# EAGLE design Campesinoi2c (EAGLE 9.6.2)
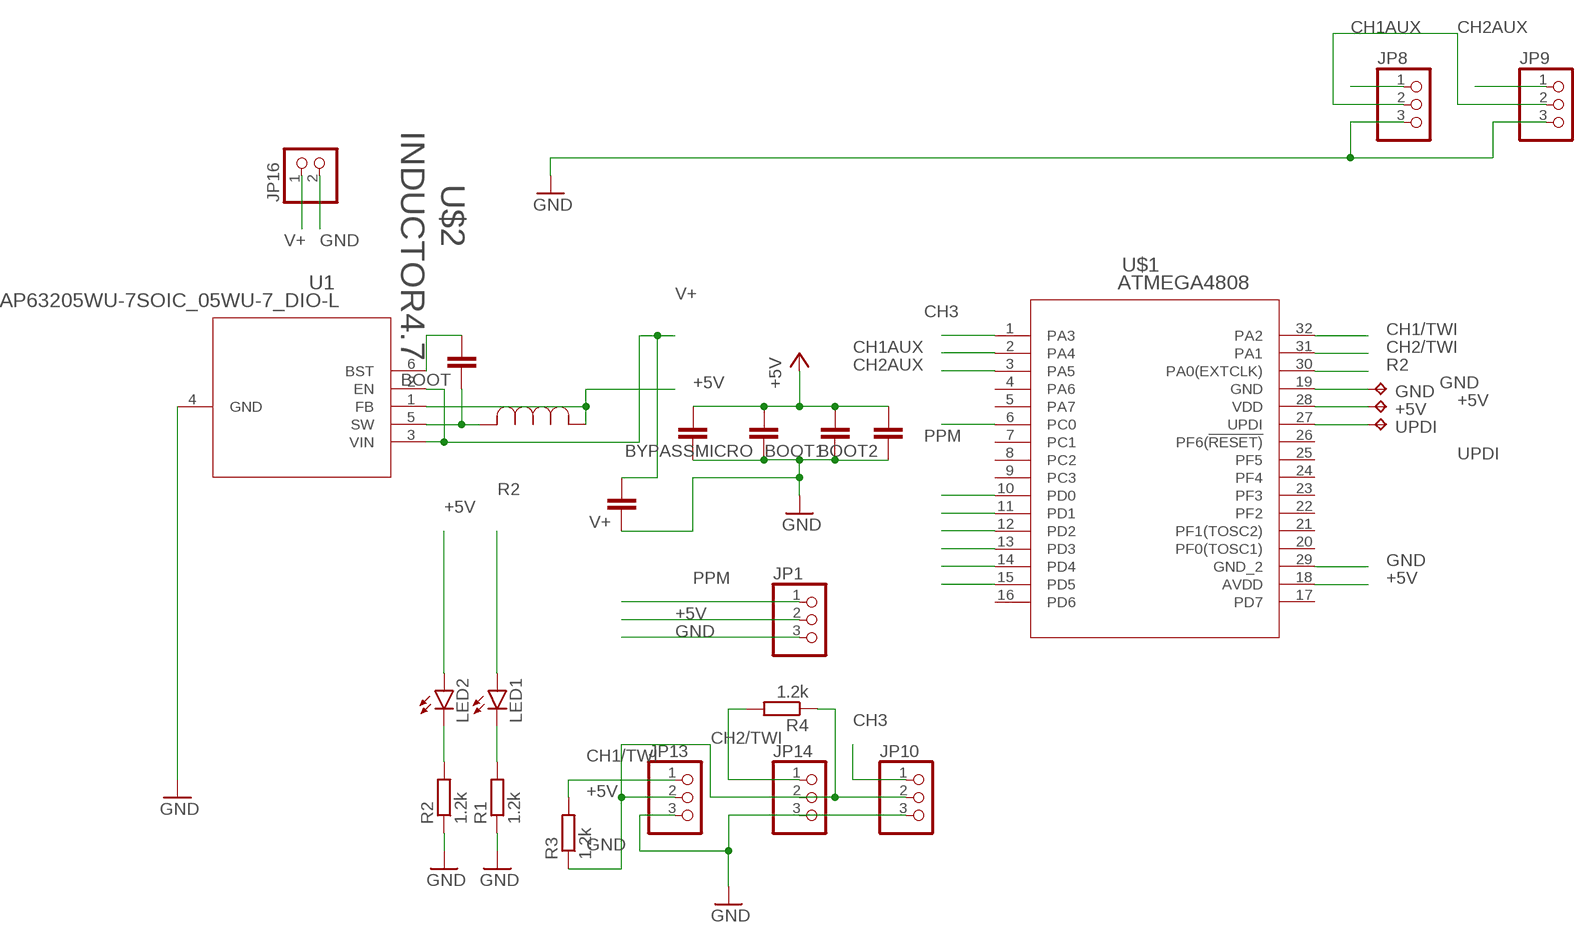
[diagram p0: schematic, sheet 1]

## Parts
+5V  TPB1,27  [B1,27]
BOOT  C-EUC0402  [C0402]
BOOT1  C-EUC0402  [C0402]
BOOT2  C-EUC0402  [C0402]
BYPASSMICRO  C-EUC0603  [C0603]
BYPASSMICRO2  C-EUC0603  [C0603]
GND  TPB1,27  [B1,27]
JP1  PINHD-1X03_2.54-S  [1X03-S]
JP8  PINHD-1X03_2.54-S  [1X03-S]
JP9  PINHD-1X03_2.54-S  [1X03-S]
JP10  PINHD-1X03_2.54-S  [1X03-S]
JP13  PINHD-1X03_2.54-S  [1X03-S]
JP14  PINHD-1X03_2.54-S  [1X03-S]
JP16  PINHD-1X02_2.54-S  [1X02-S]
LED1  LEDCHIPLED_0603  [CHIPLED_0603]
LED2  LEDCHIPLED_0603  [CHIPLED_0603]
R1  1.2k  R-EU_R0603  [R0603]
R2  1.2k  R-EU_R0603  [R0603]
R3  1.2k  R-EU_R0603  [R0603]
R4  1.2k  R-EU_R0603  [R0603]
U1  AP63205WU-7SOIC_05WU-7_DIO-L  [SOIC_05WU-7_DIO-L]
U$1  ATMEGA4808  [QFP80P900X900X120-32N]
U$2  INDUCTOR4.7  [IND_NRS5030T100MMGJ_TAY]
UPDI  TPB1,27  [B1,27]
V+  C-EUC1206  [C1206]

## Nets
+5V: +5V.TP BOOT1.2 BOOT2.2 BYPASSMICRO2.2 BYPASSMICRO.2 JP1.2 JP8.2 JP9.2 JP10.2 JP13.2 JP14.2 LED2.A R3.1 R4.1 U1.1(FB) U$1.18(AVDD) U$1.28(VDD) U$2.1
CH1/TWI: JP13.1 R3.2 U$1.32(PA2)
CH1AUX: JP8.1 U$1.2(PA4)
CH2/TWI: JP14.1 R4.2 U$1.31(PA1)
CH2AUX: JP9.1 U$1.3(PA5)
CH3: JP10.1 U$1.1(PA3)
GND: BOOT1.1 BOOT2.1 BYPASSMICRO2.1 BYPASSMICRO.1 GND.TP JP1.3 JP8.3 JP9.3 JP10.3 JP13.3 JP14.3 JP16.2 R1.1 R2.1 U1.4(GND) U$1.19(GND) U$1.29(GND_2) V+.1
N$2: LED2.C R2.2
N$15: LED1.C R1.2
N$17: BOOT.1 U1.5(SW) U$2.2
N$18: BOOT.2 U1.6(BST)
PPM: JP1.1 U$1.6(PC0)
R2: LED1.A U$1.30(PA0(EXTCLK))
SENSOR1: U$1.10(PD0)
SENSOR2: U$1.11(PD1)
SENSOR3: U$1.12(PD2)
SENSOR4: U$1.13(PD3)
SENSOR5: U$1.14(PD4)
SENSOR6: U$1.15(PD5)
UPDI: U$1.27(UPDI) UPDI.TP
V+: JP16.1 U1.2(EN) U1.3(VIN) V+.2
Unconnected: U$1.4(PA6) U$1.5(PA7) U$1.7(PC1) U$1.8(PC2) U$1.9(PC3) U$1.16(PD6) U$1.17(PD7) U$1.20(PF0(TOSC1)) U$1.21(PF1(TOSC2)) U$1.22(PF2) U$1.23(PF3) U$1.24(PF4) U$1.25(PF5) U$1.26(PF6(!RESET))

## Library data of the parts
+5V GND UPDI = testpad:TP: Test pad
BOOT BOOT1 BOOT2 BYPASSMICRO BYPASSMICRO2 V+ = rcl:C-EU: CAPACITOR, European symbol; SPICEPREFIX: C
JP1 JP8-JP10 JP13 JP14 = pinhead-2:PINHD-1X03: PIN HEADER
JP16 = pinhead-2:PINHD-1X02: PIN HEADER
LED1 LED2 = led:LED: LED OSRAM: - CHIPLED LG R971, LG N971, LY N971, LG Q971, LY Q971, LO R971, LY R971 LH N974, LH R974 LS Q976, LO Q976, LY Q976 LO Q996 - Hyper CHIPLED LW Q18S LB Q993, LB Q99A, LB R99A - SideLED LS A670, LO A670, LY A670, LG A670, LP A670 LB A673, LV A673, LT A673, LW A673 LH A674 LY A675 LS A676, LA A676, LO A676, LY A676, LW A676 LS A679, LY A679, LG A679 - Hyper Micro SIDELED® LS Y876, LA Y876, LO Y876, LY Y876 LT Y87S - SmartLED LW L88C, LW L88S LB L89C, LB L89S, LG L890 LS L89K, LO L89K, LY L89K LS L896, LA L896, LO L896, LY L896 - TOPLED LS T670, LO T670, LY T670, LG T670, LP T670 LSG T670, LSP T670, LSY T670, LOP T670, LYG T670 LG T671, LOG T671, LSG T671 LB T673, LV T673, LT T673, LW T673 LH T674 LS T676, LA T676, LO T676, LY T676, LB T676, LH T676, LSB T676, LW T676 LB T67C, LV T67C, LT T67C, LS T67K, LO T67K, LY T67K, LW E67C LS E67B, LA E67B, LO E67B, LY E67B, LB E67C, LV E67C, LT E67C LW T67C LS T679, LY T679, LG T679 LS T770, LO T770, LY T770, LG T770, LP T770 LB T773, LV T773, LT T773, LW T773 LH T774 LS E675, LA E675, LY E675, LS T675 LS T776, LA T776, LO T776, LY T776, LB T776 LHGB T686 LT T68C, LB T68C - Hyper Mini TOPLED® LB M676 - Mini TOPLED Santana® LG M470 LS M47K, LO M47K, LY M47K Source: http://www.osram.convergy.de LUXEON: - LUMILED® LXK2-PW12-R00, LXK2-PW12-S00, LXK2-PW14-U00, LXK2-PW14-V00 LXK2-PM12-R00, LXK2-PM12-S00, LXK2-PM14-U00 LXK2-PE12-Q00, LXK2-PE12-R00, LXK2-PE12-S00, LXK2-PE14-T00, LXK2-PE14-U00 LXK2-PB12-K00, LXK2-PB12-L00, LXK2-PB12-M00, LXK2-PB14-N00, LXK2-PB14-P00, LXK2-PB14-Q00 LXK2-PR12-L00, LXK2-PR12-M00, LXK2-PR14-Q00, LXK2-PR14-R00 LXK2-PD12-Q00, LXK2-PD12-R00, LXK2-PD12-S00 LXK2-PH12-R00, LXK2-PH12-S00 LXK2-PL12-P00, LXK2-PL12-Q00, LXK2-PL12-R00 Source: www.luxeon.com KINGBRIGHT: KA-3528ASYC Source: www.kingbright.com
R1-R4 = rcl:R-EU_: RESISTOR, European symbol; SPICEPREFIX: R
U1 = AP63205WU-7:AP63205WU-7; BUILT_BY: EMA_Matt; COPYRIGHT: Copyright (C) 2018 Accelerated Designs. All rights reserved; MANUFACTURER_PART_NUMBER: AP63205WU-7; SOURCELIBRARY: Diodes_Inc_2019-12-05; VENDOR: Diodes Inc
U$1 = Atmega4808:ATMEGA4808
U$2 = Inductor4.7:INDUCTOR4.7

## Board
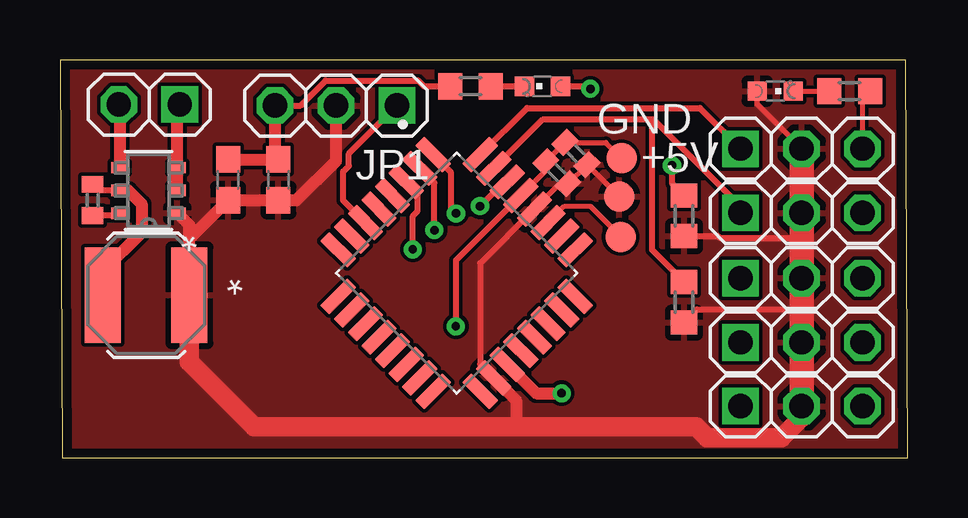
[diagram p1: board, top side]
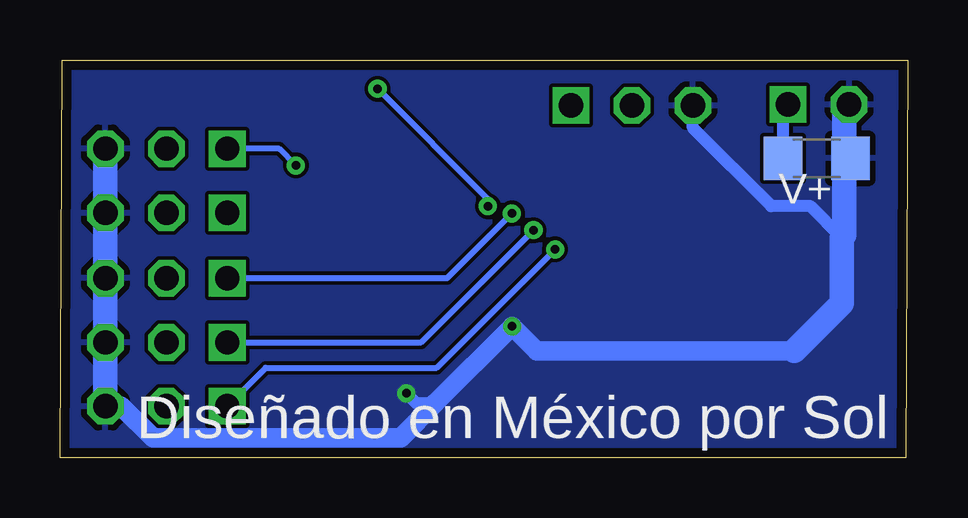
[diagram p2: board, bottom side, seen from below]

Size 35.33 x 16.6 mm. Coordinates in mm from the lower left corner, seen from the top.
Outline: 0.1,0 35.33,0 35.23,16.6 0,16.6 0.1,0
Copper layers (1*16): Top 0.035mm / dielectric 1.5mm / Bottom 0.035mm
Design rules "default *": minimum track width 6mil, minimum drill 0.35mm, track to track 6mil, track to pad 6mil, pad to pad 6mil, via to via 6mil, smd to smd 6mil, copper to edge 0.4mm, drill to drill 10mil, minimum pad ring 10mil, minimum via ring 8mil, stop-mask expansion 4mil, vias tented up to drill 0mil, thermal gap 10mil

### Footprints (pad centres in the part's own frame; a part is rotated, then mirrored left to right if it is on the bottom)
B1,27 = smd 1.27 x 1.27: TP 0,0
C0402 = smd 0.7 x 0.9: 1 -0.65,0; 2 0.65,0
C0603 = smd 1.1 x 1: 1 -0.85,0; 2 0.85,0
1X03-S = drill 1.016 square: 1 -2.54,0 | drill 1.016 octagon: 2 0,0; 3 2.54,0
1X02-S = drill 1.016 square: 1 -1.27,0 | drill 1.016 octagon: 2 1.27,0
CHIPLED_0603 = smd 0.8 x 0.8: A 0,-0.75; C 0,0.75
R0603 = smd 1 x 1.1: 1 -0.85,0; 2 0.85,0
SOIC_05WU-7_DIO-L = smd 0.696 x 0.477: 1 -1.199,0.95; 2 -1.199,0; 3 -1.199,-0.95; 4 1.199,-0.95; 5 1.199,0; 6 1.199,0.95
QFP80P900X900X120-32N = smd 1.6 x 0.55: 1 -4.18,2.8; 2 -4.18,2; 3 -4.18,1.2; 4 -4.18,0.4; 5 -4.18,-0.4; 6 -4.18,-1.2; 7 -4.18,-2; 8 -4.18,-2.8; 17 4.18,-2.8; 18 4.18,-2; 19 4.18,-1.2; 20 4.18,-0.4; 21 4.18,0.4; 22 4.18,1.2; 23 4.18,2; 24 4.18,2.8 | smd 0.55 x 1.6: 9 -2.8,-4.18; 10 -2,-4.18; 11 -1.2,-4.18; 12 -0.4,-4.18; 13 0.4,-4.18; 14 1.2,-4.18; 15 2,-4.18; 16 2.8,-4.18; 25 2.8,4.18; 26 2,4.18; 27 1.2,4.18; 28 0.4,4.18; 29 -0.4,4.18; 30 -1.2,4.18; 31 -2,4.18; 32 -2.8,4.18
IND_NRS5030T100MMGJ_TAY = smd 1.499 x 3.988: 1 -1.8,0; 2 1.8,0
C1206 = smd 1.6 x 1.8: 1 -1.4,0; 2 1.4,0

### Placement (x,y rotation side)
+5V  23.3,10.9 180 top
BOOT  1.36,10.76 270 top
BOOT1  21.5,12.7 315 top
BOOT2  20.7,11.9 315 top
BYPASSMICRO  9.1,11.6 270 top
BYPASSMICRO2  7,11.6 270 top
GND  23.4,12.5 0 top
JP1  11.5,14.7 180 top
JP8  30.9,4.82 0 top
JP9  30.9,2.16 0 top
JP10  30.9,7.5 0 top
JP13  30.9,12.9 0 top
JP14  30.9,10.22 0 top
JP16  3.72,14.74 180 top
LED1  20.1,15.5 90 top
LED2  29.8,15.3 270 top
R1  17.1,15.5 0 top
R2  32.9,15.3 180 top
R3  26,10.1 90 top
R4  26,6.5 90 top
U1  3.69,11.16 180 top
U$1  16.53,7.71 315 top
U$2  3.59,6.79 180 top
UPDI  23.36,9.22 0 top
V+  3.8,12.5 180 bottom

### Tracks (layer width: path | path; a pad name or v marks a point on that pad's centre or on a via)
+5V
  Top 0.2: JP13.2 29.05,14.75 LED2.A | U$1.28 20.83,11.44 BOOT2.2 BOOT1.2 +5V.TP | +5V.TP
  Top 0.254: U$1.28 17.5,8.11 17.5,3.91 U$1.18 | R4.1 26.55,6.2 30.9,6.2 | R3.1 27.41,9.25 27.48,9.18 30.52,9.18 30.9,8.8
  Top 0.508: U1.1 5.39,9.71 U$2.1 5.39,9.14 BYPASSMICRO2.2 BYPASSMICRO.2 9.85,10.75 11.5,12.4 JP1.2 | U$1.18 19,2.41 19,1.3
  Top 0.813: 30.9,3.5 30.88,3.48 30.88,1.67 30.05,0.84 26.97,0.84 26.51,1.3 19,1.3 8.1,1.3 5.39,4.01 U$2.1
  Top 1.016: JP9.2 30.9,3.5 JP8.2 30.9,6.2 JP10.2 30.9,8.8 JP14.2 JP13.2 30.95,12.95
  pour Top: 0.1,0 0.1,16.7 35.3,16.7 35.3,0
CH1/TWI  (via drill 0.35)
  Top 0.254: JP13.1 26.66,14.6 19.46,14.6 U$1.32 | R3.2 25.5,11.45 v25.5,12.2
  Bottom 0.254: v25.5,12.2 26.2,12.9 JP13.1
CH1AUX  (via drill 0.35)
  Top 0.254: U$1.2 15.6,11.47 v15.6,9.5
  Bottom 0.254: JP8.1 20.28,4.82 v15.6,9.5
CH2/TWI
  Top 0.254: 24.67,14.11 20.1,14.11 U$1.31 | JP14.1 28.36,10.48 24.74,14.11 24.67,14.11 | 24.67,14.11 24.67,8.68 R4.2
CH2AUX  (via drill 0.35)
  Top 0.254: v14.7,8.7 14.7,10.1 14.9,10.3 14.9,11.04 U$1.3
  Bottom 0.254: JP9.1 26.76,3.76 19.64,3.76 v14.7,8.7
CH3  (via drill 0.35)
  Top 0.254: v16.5,10.2 16.3,10.4 16.3,11.9 U$1.1
  Bottom 0.254: JP10.1 19.2,7.5 v16.5,10.2
GND  (via drill 0.35)
  Top 0.2: JP13.3 33.44,14.99 R2.1 | U$1.29 20.24,11.99 BOOT2.1 BOOT1.1 22.74,13.16 GND.TP
  Top 0.254: U$1.19 18.64,3.86 | JP1.3 10.03,14.7 11.07,15.74 14.92,15.74 15.16,15.5 R1.1 | U$1.29 16.49,8.24 v16.49,5.49
  Top 0.508: JP16.2 2.49,14.7 U1.4 | BYPASSMICRO2.1 BYPASSMICRO.1 8.96,12.59 JP1.3 | U$1.19 19.84,2.7 v20.9,2.7
  Bottom 0.254: V+.1 2.65,12.5
  Bottom 0.508: 2.65,9.3 2.75,9.2 4.05,10.5 5.7,10.5 8.96,13.76 JP1.3 | 3.15,5.9 3.3,5.9 | JP16.2 2.89,14.74 | v20.9,2.7 20.49,2.29 19.69,2.29
  Bottom 0.813: JP9.3 32.77,2.16 31.45,0.84 21.14,0.84 19.69,2.29 v16.49,5.49 15.46,4.46 4.74,4.46
  Bottom 1.016: JP16.2 2.65,14.54 2.65,12.5 2.65,9.3 | 2.75,9.2 2.75,6.45 3.3,5.9 4.74,4.46 | JP9.3 JP8.3 JP10.3 JP14.3 JP13.3 33.62,13.08
  pour Bottom: 0.1,0 0.1,16.7 35.3,16.7 35.3,0
N$2
  Top 0.2: LED2.C R2.2
N$15
  Top 0.254: R1.2 LED1.C
N$17
  Top 0.254: U1.5 1.61,11.16 BOOT.1
  Top 0.508: U1.5 2.84,11.16 3.4,10.6 3.4,9.4 1.79,7.79 U$2.2
N$18
  Top 0.254: U1.6 2.39,10.11 BOOT.2
PPM
  Top 0.254: U$1.6 11.8,10.74 11.8,11.95 12.03,12.18 12.03,12.69 JP1.1
R2  (via drill 0.35)
  Top 0.254: v17.5,10.5 18.51,11.51 U$1.30 | LED1.A 22,15.5 v22.1,15.4
  Bottom 0.254: v22.1,15.4 17.5,10.8 v17.5,10.5
UPDI
  Top 0.2: U$1.27 21.02,10.5 22.1,10.5 23.36,9.24 UPDI.TP
V+
  Top 0.508: U1.2 U1.3 4.89,14.64 JP16.1
  Bottom 0.508: V+.2 5.2,14.53 JP16.1

### Text on the board
bNames: Diseñado en México por Sol